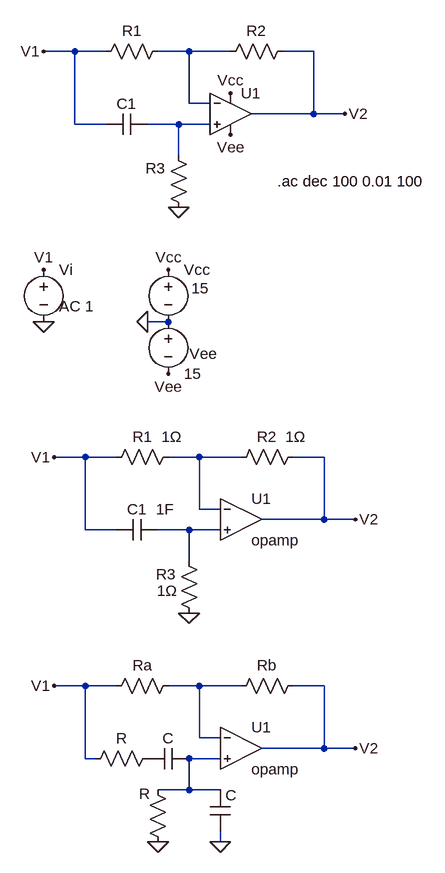
[diagram p0: schematic filtro_pasa_todo_1er_orden.asc]
filtro_pasa_todo_1er_orden.asc, the LTspice schematic file:
Version 4.1
SHEET 1 880 680
WIRE -1168 -1216 -1216 -1216
WIRE -1120 -1216 -1168 -1216
WIRE -992 -1216 -1040 -1216
WIRE -928 -1216 -992 -1216
WIRE -800 -1216 -848 -1216
WIRE -992 -1136 -992 -1216
WIRE -960 -1136 -992 -1136
WIRE -800 -1120 -800 -1216
WIRE -800 -1120 -896 -1120
WIRE -752 -1120 -800 -1120
WIRE -1168 -1104 -1168 -1216
WIRE -1120 -1104 -1168 -1104
WIRE -1008 -1104 -1056 -1104
WIRE -960 -1104 -1008 -1104
WIRE -1008 -1056 -1008 -1104
WIRE -1024 -800 -1056 -800
WIRE -1152 -592 -1200 -592
WIRE -1104 -592 -1152 -592
WIRE -976 -592 -1024 -592
WIRE -912 -592 -976 -592
WIRE -784 -592 -832 -592
WIRE -976 -512 -976 -592
WIRE -944 -512 -976 -512
WIRE -784 -496 -784 -592
WIRE -784 -496 -880 -496
WIRE -736 -496 -784 -496
WIRE -1152 -480 -1152 -592
WIRE -1104 -480 -1152 -480
WIRE -992 -480 -1040 -480
WIRE -944 -480 -992 -480
WIRE -992 -432 -992 -480
WIRE -1152 -240 -1200 -240
WIRE -1104 -240 -1152 -240
WIRE -976 -240 -1024 -240
WIRE -912 -240 -976 -240
WIRE -784 -240 -832 -240
WIRE -976 -160 -976 -240
WIRE -944 -160 -976 -160
WIRE -784 -144 -784 -240
WIRE -784 -144 -880 -144
WIRE -736 -144 -784 -144
WIRE -1152 -128 -1152 -240
WIRE -1136 -128 -1152 -128
WIRE -944 -128 -992 -128
WIRE -992 -80 -992 -128
WIRE -992 -80 -1040 -80
WIRE -944 -80 -992 -80
WIRE -944 0 -944 -16
FLAG -1216 -1216 V1
FLAG -752 -1120 V2
FLAG -1008 -976 0
FLAG -1216 -880 V1
FLAG -1216 -800 0
FLAG -928 -1152 Vcc
FLAG -928 -1088 Vee
FLAG -1056 -800 0
FLAG -1024 -720 Vee
FLAG -1024 -880 Vcc
FLAG -1200 -592 V1
FLAG -736 -496 V2
FLAG -992 -352 0
FLAG -1200 -240 V1
FLAG -736 -144 V2
FLAG -1040 0 0
FLAG -944 0 0
SYMBOL res -1024 -1232 R90
WINDOW 0 0 56 VBottom 2
WINDOW 3 32 56 Invisible 2
SYMATTR InstName R1
SYMATTR Value 1
SYMBOL res -832 -1232 R90
WINDOW 0 0 56 VBottom 2
WINDOW 3 32 56 Invisible 2
SYMATTR InstName R2
SYMATTR Value 1
SYMBOL res -992 -960 R180
WINDOW 0 36 76 Left 2
WINDOW 3 36 40 Invisible 2
SYMATTR InstName R3
SYMATTR Value 1
SYMBOL cap -1056 -1120 R90
WINDOW 0 0 32 VBottom 2
WINDOW 3 32 32 Invisible 2
SYMATTR InstName C1
SYMATTR Value 1
SYMBOL voltage -1216 -896 R0
WINDOW 3 24 44 Left 2
WINDOW 123 24 72 Left 2
WINDOW 39 0 0 Left 0
SYMATTR Value ""
SYMATTR Value2 AC 1
SYMATTR InstName Vi
SYMBOL voltage -1024 -896 R0
WINDOW 3 36 44 Left 2
WINDOW 123 0 0 Left 0
WINDOW 39 0 0 Left 0
SYMATTR Value 15
SYMATTR InstName Vcc
SYMBOL voltage -1024 -816 R0
WINDOW 0 33 65 Left 2
WINDOW 123 0 0 Left 0
WINDOW 39 0 0 Left 0
SYMATTR InstName Vee
SYMATTR Value 15
SYMBOL OpAmps\\UniversalOpAmp1 -928 -1120 R0
SYMATTR InstName U1
SYMBOL res -1008 -608 R90
WINDOW 0 0 56 VBottom 2
WINDOW 3 0 11 VBottom 2
SYMATTR InstName R1
SYMATTR Value 1Ω
SYMBOL res -816 -608 R90
WINDOW 0 0 56 VBottom 2
WINDOW 3 0 12 VBottom 2
SYMATTR InstName R2
SYMATTR Value 1Ω
SYMBOL res -976 -336 R180
WINDOW 0 36 76 Left 2
WINDOW 3 34 50 Left 2
SYMATTR InstName R3
SYMATTR Value 1Ω
SYMBOL cap -1040 -496 R90
WINDOW 0 0 32 VBottom 2
WINDOW 3 0 -11 VBottom 2
SYMATTR InstName C1
SYMATTR Value 1F
SYMBOL OpAmps\\opamp -912 -560 R0
SYMATTR InstName U1
SYMBOL res -1008 -256 R90
WINDOW 0 0 56 VBottom 2
WINDOW 3 0 11 Invisible 2
SYMATTR InstName Ra
SYMATTR Value 1Ω
SYMBOL res -816 -256 R90
WINDOW 0 0 56 VBottom 2
WINDOW 3 0 12 Invisible 2
SYMATTR InstName Rb
SYMATTR Value 1Ω
SYMBOL res -1024 16 R180
WINDOW 0 28 90 Left 2
WINDOW 3 34 50 Invisible 2
SYMATTR InstName R
SYMATTR Value 1Ω
SYMBOL cap -992 -144 R90
WINDOW 0 0 32 VBottom 2
WINDOW 3 0 -11 Invisible 2
SYMATTR InstName C
SYMATTR Value 1F
SYMBOL OpAmps\\opamp -912 -208 R0
SYMATTR InstName U1
SYMBOL res -1152 -112 R270
WINDOW 0 32 56 VTop 2
WINDOW 3 0 56 Invisible 2
SYMATTR InstName R
SYMATTR Value 1Ω
SYMBOL cap -960 -80 R0
WINDOW 3 24 56 Invisible 2
SYMATTR InstName C
TEXT -856 -1016 Left 2 !.ac dec 100 0.01 100

The netlist it stands for:
* filtro_pasa_todo_1er_orden.asc
R1 N001 V1 1
R2 V2 N001 1
R3 0 N002 1
C1 N002 V1 1
Vi V1 0 AC 1
Vcc Vcc 0 15
Vee 0 Vee 15
X§U1 N002 N001 Vcc Vee V2 level1 Avol=1Meg GBW=10Meg Vos=0 En=0 Enk=0 In=0 Ink=0 Rin=500Meg  ; pins In+ In- V+ V- OUT
R1 N003 V1 1Ω
R2 V2 N003 1Ω
R3 0 N004 1Ω
C1 N004 V1 1F
X§U1 N003 N004 V2 opamp Aol=100K GBW=10Meg  ; pins invin noninvin out
Ra N005 V1 1Ω
Rb V2 N005 1Ω
R 0 N006 1Ω
C N006 P001 1F
X§U1 N005 N006 V2 opamp Aol=100K GBW=10Meg  ; pins invin noninvin out
R V1 P001 1Ω
C N006 0 C
.ac dec 100 0.01 100
.lib UniversalOpAmp1.lib
.backanno
.end